# Altium schematic sheet Adafruit Feather M0 Basic rev C.SchDoc
size 282 x 200 mm; COMPANY: ADAFRUIT INDUSTRIES; DRAWN: KTOWN; REV: B
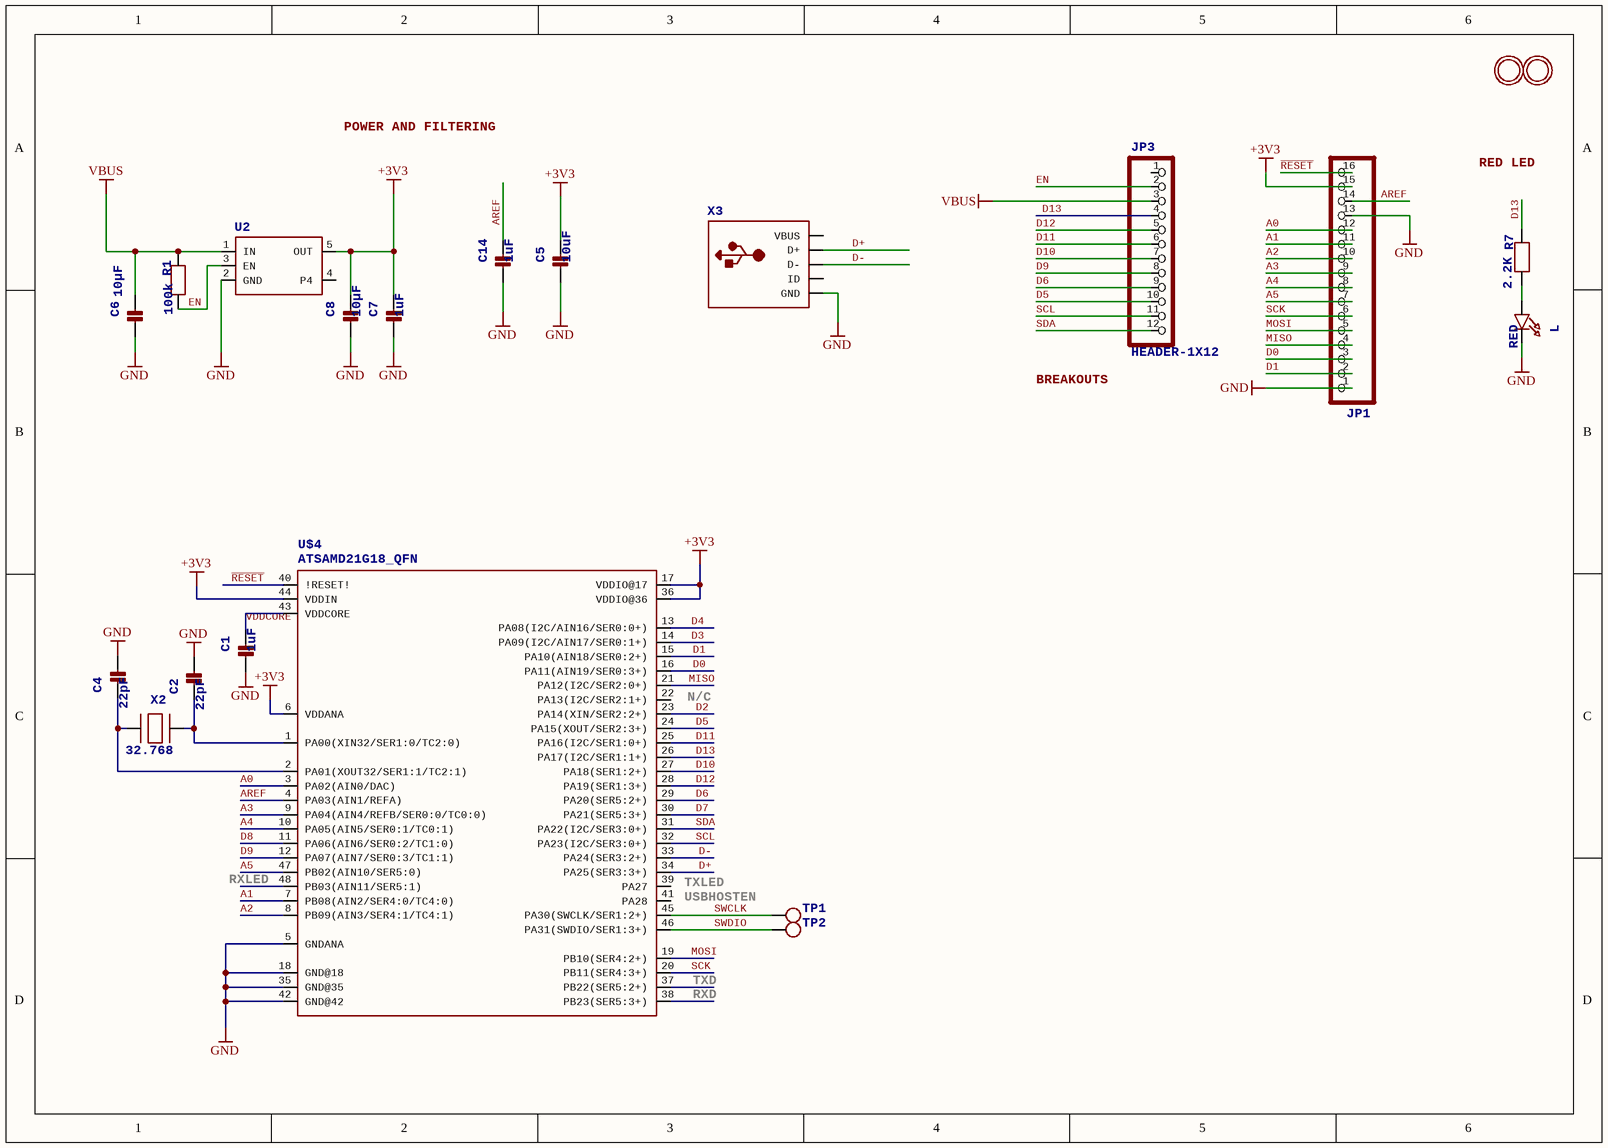
[diagram p0: Adafruit Feather M0 Basic rev C.SchDoc]

## Parts
C1  1uF  [0603-NO]
C2  22pF  [0603-NO]
C4  22pF  [0603-NO]
C5  10uF  [0805-NO]
C6  10µF  [0805-NO]
C7  1uF  [0603-NO]
C8  10µF  [0805-NO]
C14  1uF  [0603-NO]
JP1  HEADER-1X16ROUND  [1X16_ROUND]  (value not drawn)
JP3  HEADER-1X12  [1X12_ROUND]
L  RED  [CHIPLED_0805_NOOUTLINE]
R1  100k  [0603-NO]
R7  2.2K  [0603-NO]
TP1  (no value)  [TESTPOINT_ROUND_1.5MM]
TP2  (no value)  [TESTPOINT_ROUND_1.5MM]
U2  (no value)  [SOT23-5]
U$4  ATSAMD21G18_QFN  [QFN-48]
U$31  MOUNTINGHOLE2.5  [MOUNTINGHOLE_2.5_PLATED]  (value not drawn)
U$32  MOUNTINGHOLE2.5  [MOUNTINGHOLE_2.5_PLATED]  (value not drawn)
X2  32.768  [XTAL3215]
X3  (no value)  [USB-MINIB]

## Nets
+3V3: C5.1 C7.1 C8.1 JP1.15 U2.5(OUT) U$4.6(VDDANA) U$4.17(VDDIO@17) U$4.36(VDDIO@36) U$4.44(VDDIN)
GND: C1.2 C2.2 C4.2 C5.2 C6.2 C7.2 C8.2 C14.2 JP1.1 JP1.13 L.C U2.2(GND) U$4.5(GNDANA) U$4.18(GND@18) U$4.35(GND@35) U$4.42(GND@42) X3.GND
VBUS: C6.1 JP3.3 R1.1 U2.1(IN)
A0: JP1.12 U$4.3(PA02(AIN0/DAC))
A1: JP1.11 U$4.7(PB08(AIN2/SER4:0/TC4:0))
A2: JP1.10 U$4.8(PB09(AIN3/SER4:1/TC4:1))
A3: JP1.9 U$4.9(PA04(AIN4/REFB/SER0:0/TC0:0))
A4: JP1.8 U$4.10(PA05(AIN5/SER0:1/TC0:1))
A5: JP1.7 U$4.47(PB02(AIN10/SER5:0))
AREF: C14.1 JP1.14 U$4.4(PA03(AIN1/REFA))
D0: JP1.3 U$4.16(PA11(AIN19/SER0:3+))
D1: JP1.2 U$4.15(PA10(AIN18/SER0:2+))
D2: U$4.23(PA14(XIN/SER2:2+))
D3: U$4.14(PA09(I2C/AIN17/SER0:1+))
D4: U$4.13(PA08(I2C/AIN16/SER0:0+))
D5: JP3.10 U$4.24(PA15(XOUT/SER2:3+))
D6: JP3.9 U$4.29(PA20(SER5:2+))
D7: U$4.30(PA21(SER5:3+))
D8: U$4.11(PA06(AIN6/SER0:2/TC1:0))
D9: JP3.8 U$4.12(PA07(AIN7/SER0:3/TC1:1))
D10: JP3.7 U$4.27(PA18(SER1:2+))
D11: JP3.6 U$4.25(PA16(I2C/SER1:0+))
D12: JP3.5 U$4.28(PA19(SER1:3+))
D13: JP3.4 R7.1 U$4.26(PA17(I2C/SER1:1+))
D+: U$4.34(PA25(SER3:3+)) X3.D+
D-: U$4.33(PA24(SER3:2+)) X3.D-
EN: JP3.2 R1.2 U2.3(EN)
MISO: JP1.4 U$4.21(PA12(I2C/SER2:0+))
MOSI: JP1.5 U$4.19(PB10(SER4:2+))
~{RESET}: JP1.16 U$4.40(!RESET!)
SCK: JP1.6 U$4.20(PB11(SER4:3+))
SCL: JP3.11 U$4.32(PA23(I2C/SER3:0+))
SDA: JP3.12 U$4.31(PA22(I2C/SER3:0+))
SWCLK: TP1.P$1 U$4.45(PA30(SWCLK/SER1:2+))
SWDIO: TP2.P$1 U$4.46(PA31(SWDIO/SER1:3+))
VDDCORE: C1.1 U$4.43(VDDCORE)
NetC2_1: C2.1 U$4.1(PA00(XIN32/SER1:0/TC2:0)) X2.P$1
NetC4_1: C4.1 U$4.2(PA01(XOUT32/SER1:1/TC2:1)) X2.P$2
NetL_A: L.A R7.2

Not connected (* = marked no-connect by the designer): JP3 1; U2 4(P4); U$4 22(PA13(I2C/SER2:1+)) 37(PB22(SER5:2+)) 38(PB23(SER5:3+)) 39(PA27) 41(PA28) 48(PB03(AIN11/SER5:1)); X3 ID VBUS

## Notes on the sheet
- POWER AND FILTERING
- RED LED
- BREAKOUTS
- (near U$4) N/C
- (near U$4) RXLED
- (near U$4) TXLED
- USBHOSTEN
- (near U$4) TXD
- (near U$4) RXD

## Library data of the parts
C1 C2 C4 C7 C14 = CAP_CERAMIC0603_NO: <p><b>Ceramic Capacitors</b></p> / <p>For new designs, use the packages preceded by an '_' character since they are more reliable:</p> / <p>The following footprints should be used on most boards:</p> / <ul> / <li><b>_0402</b> - Standard footprint for regular board layouts</li> / <li><b>_0603</b> - Standard footprint for regular board layouts</li> / <li><b>_0805</b> - Standard footprint for regular board layouts</li> / <li><b>_1206</b> - Standard footprint for regular board layouts</li> / </ul> / <p>For extremely tight-pitch boards where space is at a premium, the following 'micro-pitch' footprints can be used (smaller pads, no silkscreen outline, etc.):</p> / <ul> / <li><b>_0402MP</b> - Micro-pitch footprint for very dense/compact boards</li> / <li><b>_0603MP</b> - Micro-pitch footprint for very dense/compact boards</li> / <li><b>_0805MP</b> - Micro-pitch footprint for very dense/compact boards</li> / <li><b>_1206MP</b> - Micro-pitch footprint for very dense/compact boards</li> / </ul>
C5 C6 C8 = CAP_CERAMIC0805-NOOUTLINE: <p><b>Ceramic Capacitors</b></p> / <p>For new designs, use the packages preceded by an '_' character since they are more reliable:</p> / <p>The following footprints should be used on most boards:</p> / <ul> / <li><b>_0402</b> - Standard footprint for regular board layouts</li> / <li><b>_0603</b> - Standard footprint for regular board layouts</li> / <li><b>_0805</b> - Standard footprint for regular board layouts</li> / <li><b>_1206</b> - Standard footprint for regular board layouts</li> / </ul> / <p>For extremely tight-pitch boards where space is at a premium, the following 'micro-pitch' footprints can be used (smaller pads, no silkscreen outline, etc.):</p> / <ul> / <li><b>_0402MP</b> - Micro-pitch footprint for very dense/compact boards</li> / <li><b>_0603MP</b> - Micro-pitch footprint for very dense/compact boards</li> / <li><b>_0805MP</b> - Micro-pitch footprint for very dense/compact boards</li> / <li><b>_1206MP</b> - Micro-pitch footprint for very dense/compact boards</li> / </ul>
JP1 = HEADER-1X16ROUND: <b>PIN HEADER</b>
L = LED0805_NOOUTLINE: <p><b>LED</b></p> / <b>0603</b> - 0603 Surface Mount Package / <hr> / <p><b><u>2mA:</u></b></p> / <ul> / <li>Green LED - Low Power (3.9mcd, 2ma, 1.7Vf) - Digikey: 475-2709-2-ND</li> / <li>Orange LED - Low Power (9.8mcd, 2ma, 1.8Vf) - Digikey: 475-1194-2-ND</li> / <li>Red LED - Low Power (5mcd, 2ma, 1.8Vf) - Digikey: 475-1195-2-ND</li> / <li>Yellow LED - Low Power (7mcd, 2ma, 1.8Vf) - Digikey: 475-1196-2-ND</li> / </ul> / <p><b><u>5mA:</u></b></p> / <ul> / <li>Blue LED - Low Power (17mcd, 5ma, 2.9Vf) - Digikey: LNJ937W8CRACT-ND</li> / </ul> / <b>0805</b> - 0805 Surface Mount Package / <hr> / <p><b><u>2mA:</u></b></p> / <ul> / <li>Red LED (8.8mcd, 2mA, 1.8Vf, Clear) - Low Power [Digikey: 475-2510-1-ND]</li> / <li>Green LED (5mcd, 2mA, 1.8Vf, Clear) - Low Power [Digikey: 475-2730-1-ND]</li> / <li>Yellow LED (11.3mcd, 2mA, 1.8Vf, Clear) - Low Power [Digikey: 475-2555-1-ND]</li> / </ul> / <p><b><u>20mA:</u></b></p> / <ul> / <li>Red LED (104mcd, 20mA, Diffused) - LS R976 [Digikey: 475-1278-6-ND]</li> / <li>Red LED (12mcd, 20mA, 2.0Vf, Clear) - APT2012EC [Digikey: 754-1128-1-ND]</li> / <li>Green LED (15mcd, 20mA, 2.2Vf, Clear) - APT2012GC [Digikey: 754-1131-1-ND]</li> / <li>Orange LED (160mcd, 20mA, 2.1Vf, Clear) - APT2012SECK [Digikey: 754-1130-1-ND]</li> / </ul> / <li><b>1206</b> - 1206 Surface Mount Package / <hr> / <ul> / <li>Green LED (26mcd, 20mA, Diffused) - LG N971  [Digikey: 475-1407-6-ND]</li> / <li>Red LED (15mcd, 20mA, Diffused) - LH N974 [Digikey: 475-1416-6-ND]</li> / </ul> / <li><b>Cree</b> - Cree High-Power Surface Mount LEDs / <hr> / <ul> / <li>XPEBWT-L1-0000-00D50 - White 111lm 350mA 2.9Vf 6200K 110°</li> / <li>XTEAWT-00-0000-00000LEE3 - White 114lm 350mA 2.85Vf 5000K 115°</li> / </ul> / <li><b>Everlight</b> - Everlight 45-21 Series Surface Mount LEDs / <hr> / <ul> / <li>45-21/QK2C-B2832AC2CB2/2T - Warm White 2000mcd 20mA 3.25Vf 3050K 120°</li> / <li>45-21/LK2C-B38452C4CB2/2T - Nuetral White 2000mcd 20mA 3.25Vf 4150K 120°</li> / <li>45-21/LK2C-B50634C6CB2/2T - Cold White 2200mcd 20mA 3.25Vf 5650K 120°</li> / </ul> / <li><b>PLCC2 Reverse Mount</b> / <hr> / <ul> / <li>LS T77K-J1L2-1-0-2-R18-Z - Red 11.25mcd 2mA 1.8Vf 630nm 120°</li> / <li>LO T77K-L1M2-24-Z - Orange 19.6mcd 2mA 1.8Vf 606nm 120°</li> / <li>LY T77K-K2M1-26-Z - Yellow 15.7mcd 2mA 1.8Vf 587nm 120°</li> / </ul>
R1 R7 = RESISTOR_0603_NOOUT: <p><b>Resistors</b></p> / <p>For new designs, use the packages preceded by an '_' character since they are more reliable:</p> / <p>The following footprints should be used on most boards:</p> / <ul> / <li><b>_0402</b> - Standard footprint for regular board layouts</li> / <li><b>_0603</b> - Standard footprint for regular board layouts</li> / <li><b>_0805</b> - Standard footprint for regular board layouts</li> / <li><b>_1206</b> - Standard footprint for regular board layouts</li> / </ul> / <p>For extremely tight-pitch boards where space is at a premium, the following 'micro-pitch' footprints can be used (smaller pads, no silkscreen outline, etc.):</p> / <ul> / <li><b>_0402MP</b> - Micro-pitch footprint for very dense/compact boards</li> / <li><b>_0603MP</b> - Micro-pitch footprint for very dense/compact boards</li> / <li><b>_0805MP</b> - Micro-pitch footprint for very dense/compact boards</li> / <li><b>_1206MP</b> - Micro-pitch footprint for very dense/compact boards</li> / </ul>
TP1 TP2 = TESTPOINTROUND1.5MM
U2 = VREG_SOT23-5
U$4 = ATSAMD21G-M
U$31 U$32 = MOUNTINGHOLE2.5: <b>Mounting Hole</b> / <p>For #2 screws (0.086"/2.18mm width, 0.094"/2.4mm hole) use 2.5mm</p>; BOM: EXCLUDE
X2 = XTAL-3.2X1.5: Low cost SMT crystals, no capacitors included / <p>http://www.ladyada.net/library/eagle</p>
X3 = USBMINIB